# Altium project CPC-UNIFEI.PrjPcb (part 2 of 4)

## Sheet USB.SchDoc
size A4; SheetNumber: 5; SheetTotal: 14
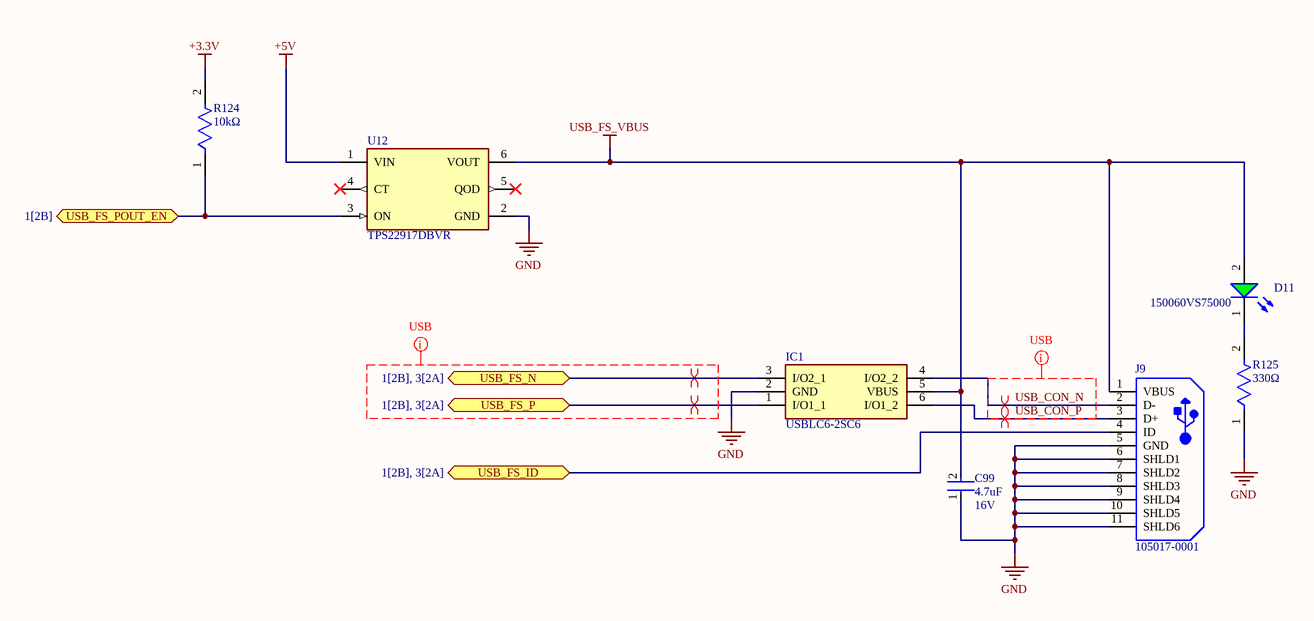
[diagram p2: USB.SchDoc]

### Parts
C99  Voltage: 16V  Capacitance: 4.7uF  [FP-C1608-080-0_1-IPC_B]  (hidden comment: C1608X5R1C475K080AC)
D11  150060VS75000  [WL-SMCW_0603_150060xx75000]
IC1  USBLC6-2SC6  [SOT95P280X145-6N]
J9  105017-0001  [USB-MICRO-B_V]
R124  Resistance: 10kΩ  [FP-RC0603-0_55-IPC_B]  (hidden comment: RC0603FR-0710KL)
R125  Resistance: 330Ω  [FP-CRCW0603-e3-MFG]  (hidden comment: CRCW0603330RFKEA)
U12  TPS22917DBVR  [FP-DBV0006A-MFG]

### Ports
USB_FS_ID (bidir, see 1[2B], 3[2A]), USB_FS_N (bidir, see 1[2B], 3[2A]), USB_FS_P (bidir, see 1[2B], 3[2A]), USB_FS_POUT_EN (bidir, see 1[2B])

### Nets
+3.3V: R124.2
+5V: U12.1(VIN)
GND: C99.1 IC1.2(GND) J9.5(GND) J9.6(SHLD1) J9.7(SHLD2) J9.8(SHLD3) J9.9(SHLD4) J9.10(SHLD5) J9.11(SHLD6) R125.1 U12.2(GND)
USB_FS_VBUS: C99.2 D11.2(A) IC1.5(VBUS) J9.1(VBUS) U12.6(VOUT)
PA10: J9.4(ID) ; port USB_FS_ID
PD10: R124.1 U12.3(ON) ; port USB_FS_POUT_EN
USB_CON_N: IC1.4(I/O2_2) J9.2(D-)
USB_CON_P: IC1.6(I/O1_2) J9.3(D+)
USB_FS_N: IC1.3(I/O2_1) ; port USB_FS_N
USB_FS_P: IC1.1(I/O1_1) ; port USB_FS_P
NetD11_1: D11.1(K) R125.2

Not connected (* = marked no-connect by the designer): U12 4(CT)* 5(QOD)*

### Layout directives
differential pair: USB_CON_N, USB_CON_P, USB_FS_N, USB_FS_P
net class USB; rule Differential Pairs Routing [Pref Gap = 7.874mil    Min Gap  = 7.874mil    Max Gap  = 7.874milPref Width = 5.566mil    Min Width  = 4.547mil    Max Width  = 7mil]: (no net found under the mark), USB_CON_N, USB_CON_P

### Library data of the parts
C99 = CMP-2000-04981-2: Multilayer Ceramic Capacitors 4.7μF ±10% 16V X5R SMD 0603; Tolerance: 10%; Thickness: 0.035inch; Length: 1.6mm; Width: 0.031inch; Height: 0.8mm; Package Quantity: 1; Construction: Flat; Weight: 7.1E-05oz; Depth: 0.8mm; Case Code (Metric): 1608; Series: C; Lead Free: Lead Free; Voltage Rating: 16V; Voltage Rating (DC): 16V; Termination: SMD/SMT; Dielectric: X5R; REACH SVHC: No SVHC; RoHS Compliant: Yes; Case Code (Imperial): 0603; Case/Package: 0603; Mount: Surface Mount; Dielectric Material: Ceramic; Packaging: Tape and Reel; Min Operating Temperature: -55°C; Max Operating Temperature: 85°C
D11 = CMP-1426-00006-6: NexarPartId: 29717778; Reverse Voltage: 5V; Forward Voltage: 2V; Viewing Angle: 140°; Luminous Intensity: 40mcd; Test Current: 20mA; Max Junction Temperature (Tj): 95°C; Wavelength: 570nm; Forward Current: 100mA; Color: Green; Lens Style: Clear, Rectangular; Power Dissipation: 72mW; Peak Wavelength: 572nm; Packaging: Tape and Reel; REACH SVHC: Unknown; Width: 800µm; Max Operating Temperature: 85°C; Number of Pins: 2; RoHS: Compliant; Dominant Wavelength: 570nm; Min Operating Temperature: -40°C; Case Code (Imperial): 0603; Height: 700µm; Length: 1.6mm; Case Code (Metric): 1608; Case/Package: 0603; Max Reverse Voltage (DC): 5V; Mount: Surface Mount
IC1 = USBLC6-2SC6: Integrated Circuit; Manufacturer_Name: STMicroelectronics; Datasheet Link: http://www.st.com/st-web-ui/static/active/en/resource/technical/document/datasheet/CD00050750.pdf; Height: 1.45mm; Manufacturer_Part_Number: USBLC6-2SC6; Mouser Part Number: 511-USBLC6-2SC6; Mouser Price/Stock: https://www.mouser.co.uk/ProductDetail/STMicroelectronics/USBLC6-2SC6?qs=po45yt2pPpu%2FhNIlwQdTlg%3D%3D; Arrow Part Number: USBLC6-2SC6; Arrow Price/Stock: https://www.arrow.com/en/products/usblc6-2sc6/stmicroelectronics?region=nac
J9 = CMP-2000-05827-1: Micro-USB B Receptacle, Right Angle, Bottom Mount, Surface Mount, with Solder Tabs, -30 to 85 degC, 5-Pin USB, RoHS, Tape and Reel; Manufacturer: Molex; Featured Product: Micro-USBConnectorsUSBConnectors; Other Names: WM1399DKR; Package Version: Rev. F, 12/2012; Number of Contacts: 5; Connector Type: USB-microB; Catalog Drawings: 1050170001; 3D Model: 105017-0001.stp; Mating Products: WM17145-ND-CABLEMICROUSBBTOSTDA1.0MWM17147-ND-CABLEMICROUSBBTOSTDA2.0MWM17146-ND-CABLEMICROUSBBTOSTDA1.5M; PCN Assembly/Origin: ResinSupplier21/Oct/2015; Voltage - Max: 30V; Online Catalog: Molex-MicroUSB; Manufacturer URL: http://www.molex.com/; Package Description: 5-Leads USB, Micro B, Body 7.5 x 5 mm, Pitch 0.65 mm; Datasheet URL: http://www.molex.com/elqNow/elqRedir.htm?ref=http://www.molex.com/webdocs/datasheets/pdf/en-us/1050170001_IO_CONNECTORS.pdf; Ingress Protection: -; Datasheet Version: 03/2016; Mounting Type: BoardCutout,SurfaceMount,RightAngle; Circuits: 5; Standard Package: 1; Package Reference: MICRO-B; Package URL: http://www.molex.com/pdm_docs/sd/1050170001_sd.pdf; Category: Connectors,Interconnects; Series: -; RoHS Information: 1050170001CertofCompliance; Features: Shielded,SolderRetention; Family: USB,DVI,HDMIConnectors; Specifications: -; Gender: Receptacle; Packaging: Digi-Reel®; Mounting Technology: SurfaceMount
R124 = CMP-2100-03664-2: RES 10K OHM 1% 1/10W 0603; Voltage Rating: 75V; Voltage Rating (DC): 50V; Power Rating: 100mW; Temperature Coefficient: 100ppm/°C; Depth: 0.8mm; Termination: SMD/SMT; Resistor Type: Thick Film; Series: RC; Construction: Rectangular; Features: Moisture Resistant; Packaging: Tape and Reel; Min Operating Temperature: -55°C; Number of Terminations: 2; Lead Pitch: 0.3mm; RoHS Compliant: Yes; Case/Package: 0603; Resistance Tolerance: 1%; Military Standard: Not; Weight: 7.1E-05oz; Number of Pins: 2; Tolerance: 1%; Length: 1.6mm; Case Code (Imperial): 0603; Lead Free: Lead Free; Width: 0.8mm; Max Power Dissipation: 100mW; Height: 0.45mm; Max Operating Temperature: 155°C; Case Code (Metric): 1608; Size Code: 0603
R125 = CMP-1012-00454-3: RES Thick Film, 330Ω, 1%, 0.1W, 100ppm/°C, 0603; Voltage Rating: 75V; Max Power Dissipation: 100mW; Depth: 0.85mm; Contact Plating: Tin; Package Quantity: 10; Termination: SMD/SMT; Tolerance: 1%; Height: 0.45mm; Number of Terminations: 2; Radiation Hardening: No; Features: Automotive AEC-Q200; Case/Package: 0603; Mount: Surface Mount; Case Code (Metric): 1608; Lead Free: Lead Free; Temperature Coefficient: 100ppm/°C; Weight: 7.1E-05oz; Military Standard: Not; Packaging: Tape and Reel; Max Operating Temperature: 155°C; Voltage Rating (DC): 75V; Length: 1.55mm; Min Operating Temperature: -55°C; Composition: Thick Film; Case Code (Imperial): 0603; Width: 0.033inch; Power Rating: 100mW
U12 = CMP-04912-000029-1: IC PWR SWITCH P-CHAN 1:1 SOT23-6; Number of Outputs: 1; Output Configuration: High Side; Fault Protection: Reverse Current; Interface: On/Off; Max Output Current: 2A; Max Operating Temperature: 125°C; Case/Package: SOT-23-6; Packaging: Tape and Reel; Number of Channels: 1; Min Operating Temperature: -40°C

## Sheet STM32_IO.SchDoc
size A3; SheetNumber: 3; SheetTotal: 14
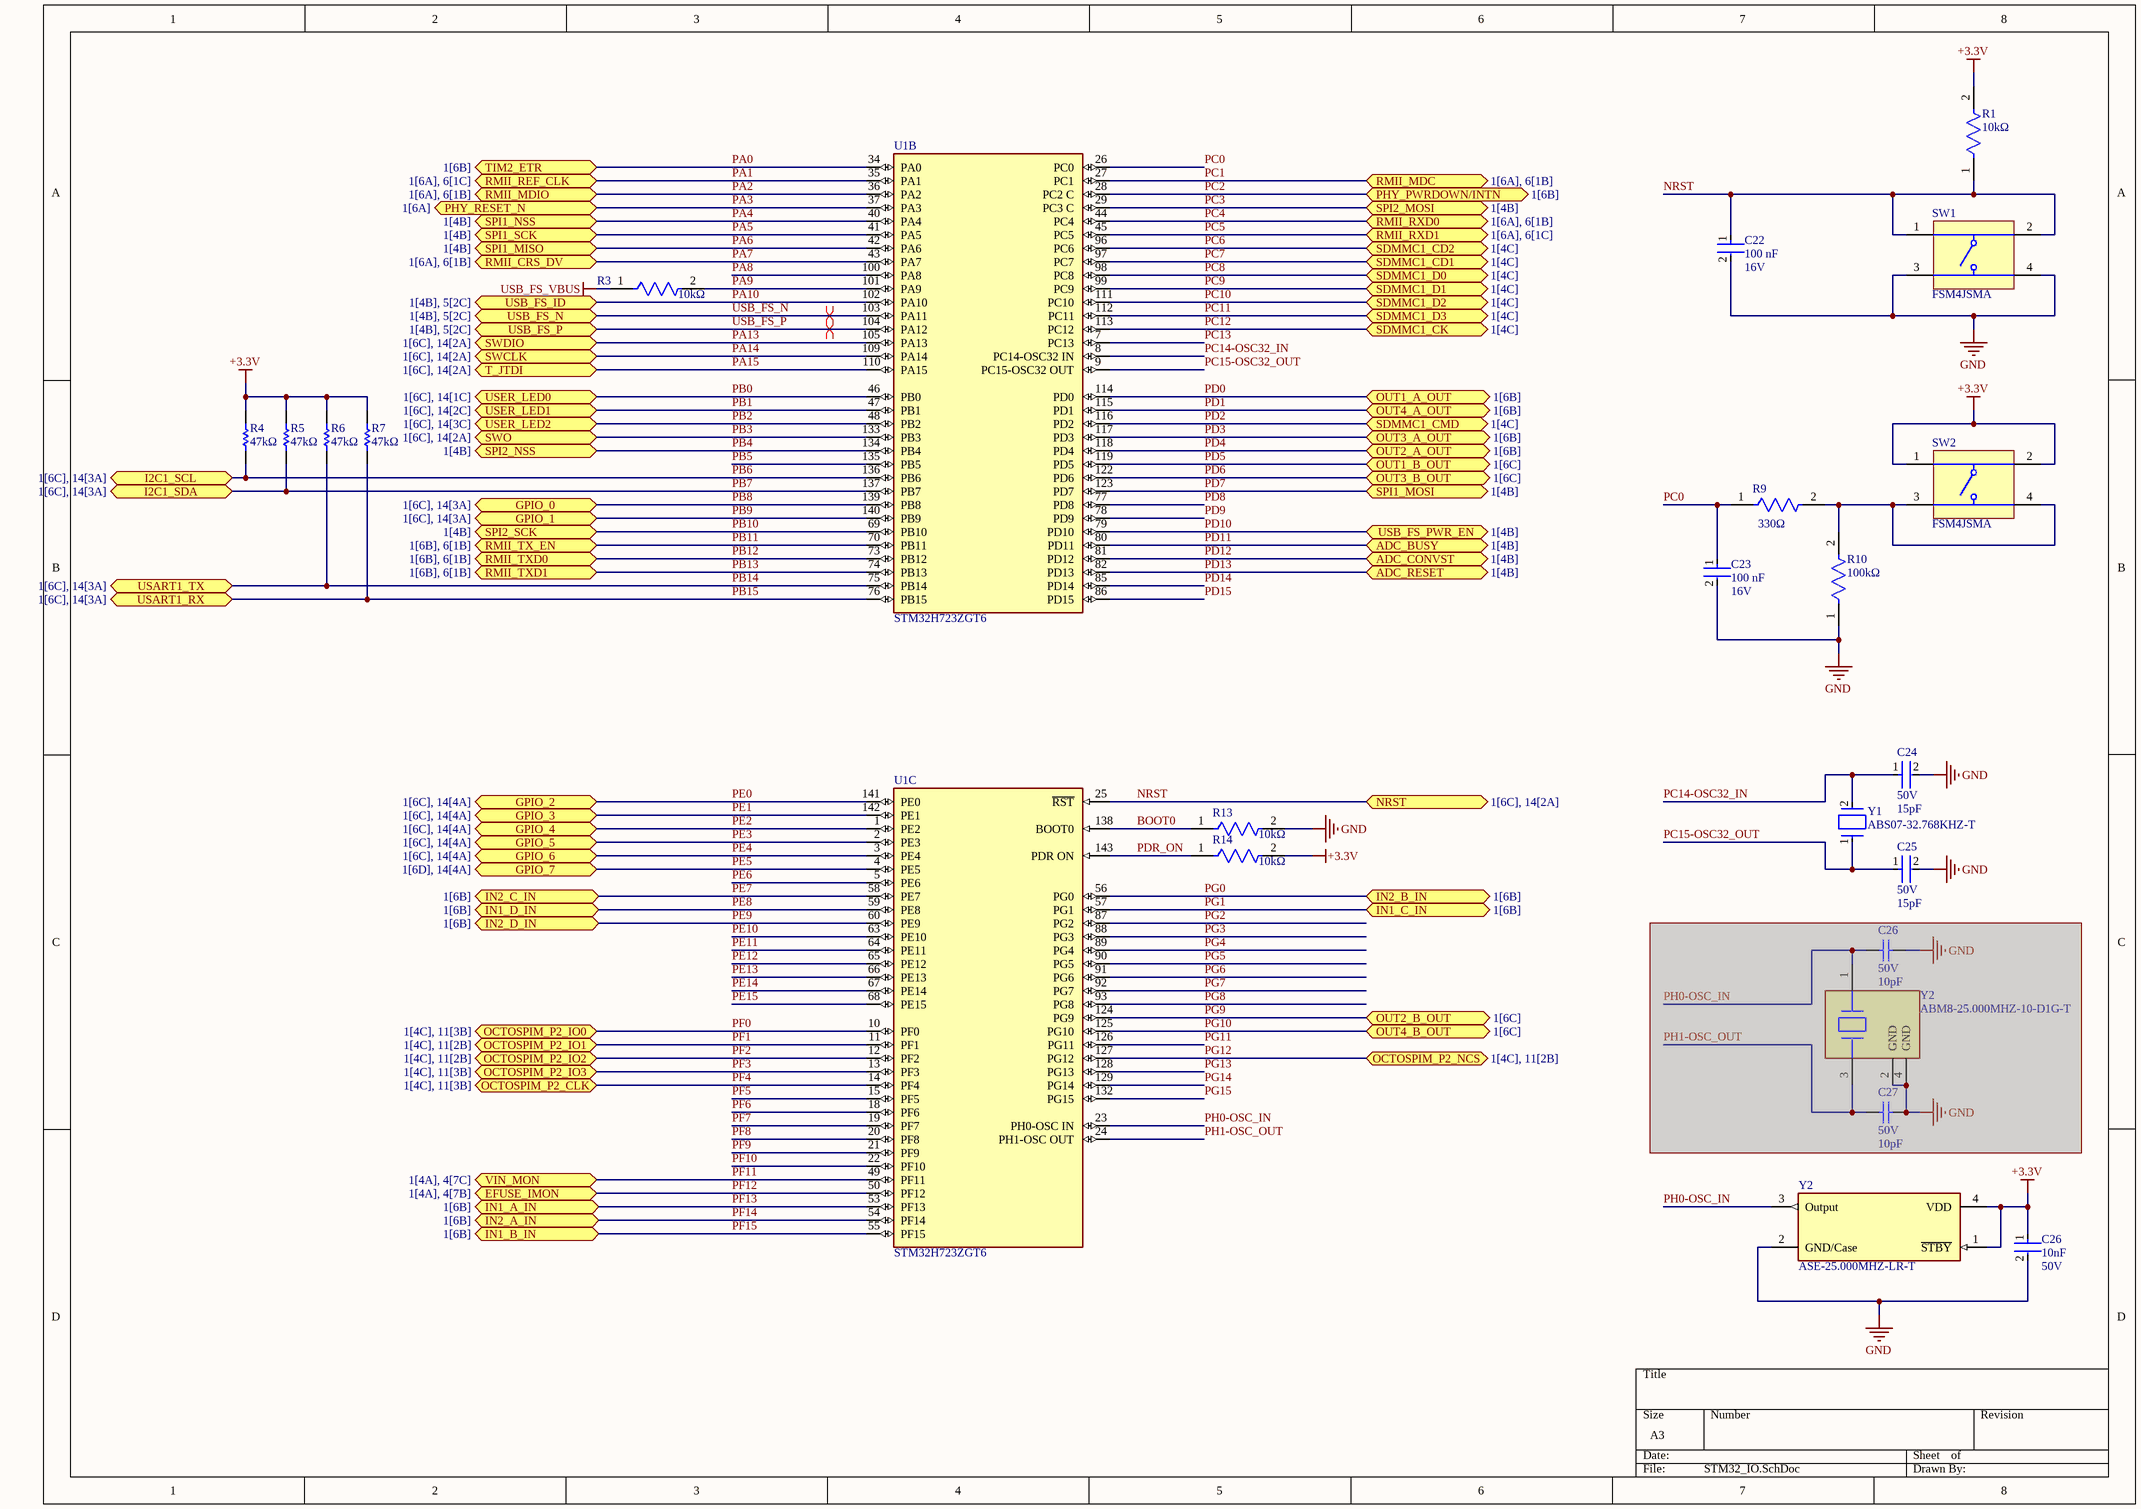
[diagram p3: STM32_IO.SchDoc]

### Parts
(Parts that share a designator on the sheet are numbered #1, #2 ... from top to bottom, then left to right.)
C22  Capacitance: 100 nF  Voltage Rating: 16V  [FP-CL752-IPC_B]  (hidden comment: CL05B104KO5VPNC)
C23  Capacitance: 100 nF  Voltage Rating: 16V  [FP-CL752-IPC_B]  (hidden comment: CL05B104KO5VPNC)
C24  Voltage: 50V  Capacitance: 15pF  [FP-0402-L_1_0_1-W_0_5_0_1-IPC_B]  (hidden comment: 04025A150JAT2A)
C25  Voltage: 50V  Capacitance: 15pF  [FP-0402-L_1_0_1-W_0_5_0_1-IPC_B]  (hidden comment: 04025A150JAT2A)
C26#1  Voltage Rating: 50V  Capacitance: 10pF  [CAPC1005X55X25NL05T05]  (hidden comment: CC0402JRNPO9BN100)  (masked out: inside a compile mask, not in the netlist)
C26#2  Voltage: 50V  Capacitance: 10nF  [FP-CL165-IPC_B]  (hidden comment: CL05B103KB5NNNC)
C27#1  Voltage Rating: 50V  Capacitance: 10pF  [CAPC1005X55X25NL05T05]  (hidden comment: CC0402JRNPO9BN100)  (masked out: inside a compile mask, not in the netlist)
R1  Resistance: 10kΩ  [FP-RC0603-0_55-IPC_B]  (hidden comment: RC0603FR-0710KL)
R3  Resistance: 10kΩ  [FP-RC0603-0_55-IPC_B]  (hidden comment: RC0603FR-0710KL)
R4  Resistance: 47kΩ  [RESC1608X55X25ML10T15]  (hidden comment: RC0603FR-1347KL)
R5  Resistance: 47kΩ  [RESC1608X55X25ML10T15]  (hidden comment: RC0603FR-1347KL)
R6  Resistance: 47kΩ  [RESC1608X55X25ML10T15]  (hidden comment: RC0603FR-1347KL)
R7  Resistance: 47kΩ  [RESC1608X55X25ML10T15]  (hidden comment: RC0603FR-1347KL)
R9  Resistance: 330Ω  [FP-CRCW0603-e3-MFG]  (hidden comment: CRCW0603330RFKEA)
R10  Resistance: 100kΩ  [FP-CRCW0603-e3-IPC_B]  (hidden comment: CRCW0603100KFKEC)
R13  Resistance: 10kΩ  [FP-RC0603-0_55-IPC_B]  (hidden comment: RC0603FR-0710KL)
R14  Resistance: 10kΩ  [FP-RC0603-0_55-IPC_B]  (hidden comment: RC0603FR-0710KL)
SW1  FSM4JSMA  [TECO-FSM4JSMA_V]
SW2  FSM4JSMA  [TECO-FSM4JSMA_V]
U1  STM32H723ZGT6  [CQFP50P2200X2200X160-144M]  (parts B,C of 3)
Y1  ABS07-32.768KHZ-T  [FP-ABS07-MFG]
Y2#1  ABM8-25.000MHZ-10-D1G-T  [FP-ABM8-MFG]  (masked out: inside a compile mask, not in the netlist)
Y2#2  ASE-25.000MHZ-LR-T  [FP-ASE-MFG]

### Ports
ADC_BUSY (bidir, see 1[4B]), ADC_CONVST (bidir, see 1[4B]), ADC_RESET (bidir, see 1[4B]), EFUSE_IMON (bidir, see 1[4A], 4[7B]), GPIO_0 (bidir, see 1[6C], 14[3A]), GPIO_1 (bidir, see 1[6C], 14[3A]), GPIO_2 (bidir, see 1[6C], 14[4A]), GPIO_3 (bidir, see 1[6C], 14[4A]), GPIO_4 (bidir, see 1[6C], 14[4A]), GPIO_5 (bidir, see 1[6C], 14[4A]), GPIO_6 (bidir, see 1[6C], 14[4A]), GPIO_7 (bidir, see 1[6D], 14[4A]), I2C1_SCL (bidir, see 1[6C], 14[3A]), I2C1_SDA (bidir, see 1[6C], 14[3A]), IN1_A_IN (bidir, see 1[6B]), IN1_B_IN (bidir, see 1[6B]), IN1_C_IN (bidir, see 1[6B]), IN1_D_IN (bidir, see 1[6B]), IN2_A_IN (bidir, see 1[6B]), IN2_B_IN (bidir, see 1[6B]), IN2_C_IN (bidir, see 1[6B]), IN2_D_IN (bidir, see 1[6B]), NRST (bidir, see 1[6C], 14[2A]), OCTOSPIM_P2_CLK (bidir, see 1[4C], 11[3B]), OCTOSPIM_P2_IO0 (bidir, see 1[4C], 11[3B]), OCTOSPIM_P2_IO1 (bidir, see 1[4C], 11[2B]), OCTOSPIM_P2_IO2 (bidir, see 1[4C], 11[2B]), OCTOSPIM_P2_IO3 (bidir, see 1[4C], 11[3B]), OCTOSPIM_P2_NCS (bidir, see 1[4C], 11[2B]), OUT1_A_OUT (bidir, see 1[6B]), OUT1_B_OUT (bidir, see 1[6C]), OUT2_A_OUT (bidir, see 1[6B]), OUT2_B_OUT (bidir, see 1[6C]), OUT3_A_OUT (bidir, see 1[6B]), OUT3_B_OUT (bidir, see 1[6C]), OUT4_A_OUT (bidir, see 1[6B]), OUT4_B_OUT (bidir, see 1[6C]), PHY_PWRDOWN/INTN (bidir, see 1[6B]), PHY_RESET_N (bidir, see 1[6A]), RMII_CRS_DV (bidir, see 1[6A], 6[1B]), RMII_MDC (bidir, see 1[6A], 6[1B]), RMII_MDIO (bidir, see 1[6A], 6[1B]), RMII_REF_CLK (bidir, see 1[6A], 6[1C]), RMII_RXD0 (bidir, see 1[6A], 6[1B]), RMII_RXD1 (bidir, see 1[6A], 6[1C]), RMII_TX_EN (bidir, see 1[6B], 6[1B]), RMII_TXD0 (bidir, see 1[6B], 6[1B]), RMII_TXD1 (bidir, see 1[6B], 6[1B]), SDMMC1_CD1 (bidir, see 1[4C]), SDMMC1_CD2 (bidir, see 1[4C]), SDMMC1_CK (bidir, see 1[4C]), SDMMC1_CMD (bidir, see 1[4C]), SDMMC1_D0 (bidir, see 1[4C]), SDMMC1_D1 (bidir, see 1[4C]), SDMMC1_D2 (bidir, see 1[4C]), SDMMC1_D3 (bidir, see 1[4C]), SPI1_MISO (bidir, see 1[4B]), SPI1_MOSI (bidir, see 1[4B]), SPI1_NSS (bidir, see 1[4B]), SPI1_SCK (bidir, see 1[4B]), SPI2_MOSI (bidir, see 1[4B]), SPI2_NSS (bidir, see 1[4B]), SPI2_SCK (bidir, see 1[4B]), SWCLK (bidir, see 1[6C], 14[2A]), SWDIO (bidir, see 1[6C], 14[2A]), SWO (bidir, see 1[6C], 14[2A]), T_JTDI (bidir, see 1[6C], 14[2A]), TIM2_ETR (bidir, see 1[6B]), USART1_RX (bidir, see 1[6C], 14[3A]), USART1_TX (bidir, see 1[6C], 14[3A]), USB_FS_ID (bidir, see 1[4B], 5[2C]), USB_FS_N (bidir, see 1[4B], 5[2C]), USB_FS_P (bidir, see 1[4B], 5[2C]), USB_FS_PWR_EN (bidir, see 1[4B]), USER_LED0 (bidir, see 1[6C], 14[1C]), USER_LED1 (bidir, see 1[6C], 14[2C]), USER_LED2 (bidir, see 1[6C], 14[3C]), VIN_MON (bidir, see 1[4A], 4[7C])

### Nets
+3.3V: C26#2.1 R1.2 R4.2 R5.2 R6.2 R7.2 R14.2 SW2.1 SW2.2 Y2#2.1(~{STBY}) Y2#2.4(VDD)
GND: C22.2 C23.2 C24.2 C25.2 C26#2.2 R10.1 R13.2 SW1.3 SW1.4 Y2#2.2(GND/Case)
USB_FS_VBUS: R3.1
BOOT0: R13.1 U1.138(BOOT0)
NRST: C22.1 R1.1 SW1.1 SW1.2 U1.25(~{RST}) ; port NRST
PA0: U1.34(PA0) ; port TIM2_ETR
PA1: U1.35(PA1) ; port RMII_REF_CLK
PA2: U1.36(PA2) ; port RMII_MDIO
PA3: U1.37(PA3) ; port PHY_RESET_N
PA4: U1.40(PA4) ; port SPI1_NSS
PA5: U1.41(PA5) ; port SPI1_SCK
PA6: U1.42(PA6) ; port SPI1_MISO
PA7: U1.43(PA7) ; port RMII_CRS_DV
PA8: U1.100(PA8)
PA9: R3.2 U1.101(PA9)
PA10: U1.102(PA10) ; port USB_FS_ID
PA13: U1.105(PA13) ; port SWDIO
PA14: U1.109(PA14) ; port SWCLK
PA15: U1.110(PA15) ; port T_JTDI
PB0: U1.46(PB0) ; port USER_LED0
PB1: U1.47(PB1) ; port USER_LED1
PB2: U1.48(PB2) ; port USER_LED2
PB3: U1.133(PB3) ; port SWO
PB4: U1.134(PB4) ; port SPI2_NSS
PB5: U1.135(PB5)
PB6: R4.1 U1.136(PB6) ; port I2C1_SCL
PB7: R5.1 U1.137(PB7) ; port I2C1_SDA
PB8: U1.139(PB8) ; port GPIO_0
PB9: U1.140(PB9) ; port GPIO_1
PB10: U1.69(PB10) ; port SPI2_SCK
PB11: U1.70(PB11) ; port RMII_TX_EN
PB12: U1.73(PB12) ; port RMII_TXD0
PB13: U1.74(PB13) ; port RMII_TXD1
PB14: R6.1 U1.75(PB14) ; port USART1_TX
PB15: R7.1 U1.76(PB15) ; port USART1_RX
PC0: C23.1 R9.1 U1.26(PC0)
PC1: U1.27(PC1) ; port RMII_MDC
PC2: U1.28(PC2_C) ; port PHY_PWRDOWN/INTN
PC3: U1.29(PC3_C) ; port SPI2_MOSI
PC4: U1.44(PC4) ; port RMII_RXD0
PC5: U1.45(PC5) ; port RMII_RXD1
PC6: U1.96(PC6) ; port SDMMC1_CD2
PC7: U1.97(PC7) ; port SDMMC1_CD1
PC8: U1.98(PC8) ; port SDMMC1_D0
PC9: U1.99(PC9) ; port SDMMC1_D1
PC10: U1.111(PC10) ; port SDMMC1_D2
PC11: U1.112(PC11) ; port SDMMC1_D3
PC12: U1.113(PC12) ; port SDMMC1_CK
PC13: U1.7(PC13)
PC14-OSC32_IN: C24.1 U1.8(PC14-OSC32_IN) Y1.2
PC15-OSC32_OUT: C25.1 U1.9(PC15-OSC32_OUT) Y1.1
PD0: U1.114(PD0) ; port OUT1_A_OUT
PD1: U1.115(PD1) ; port OUT4_A_OUT
PD2: U1.116(PD2) ; port SDMMC1_CMD
PD3: U1.117(PD3) ; port OUT3_A_OUT
PD4: U1.118(PD4) ; port OUT2_A_OUT
PD5: U1.119(PD5) ; port OUT1_B_OUT
PD6: U1.122(PD6) ; port OUT3_B_OUT
PD7: U1.123(PD7) ; port SPI1_MOSI
PD8: U1.77(PD8)
PD9: U1.78(PD9)
PD10: U1.79(PD10) ; port USB_FS_PWR_EN
PD11: U1.80(PD11) ; port ADC_BUSY  [project net ADC_BUSY]
PD12: U1.81(PD12) ; port ADC_CONVST  [project net ADC_CONVST]
PD13: U1.82(PD13) ; port ADC_RESET  [project net ADC_RESET]
PD14: U1.85(PD14)
PD15: U1.86(PD15)
PDR_ON: R14.1 U1.143(PDR_ON)
PE0: U1.141(PE0) ; port GPIO_2
PE1: U1.142(PE1) ; port GPIO_3
PE2: U1.1(PE2) ; port GPIO_4
PE3: U1.2(PE3) ; port GPIO_5
PE4: U1.3(PE4) ; port GPIO_6
PE5: U1.4(PE5) ; port GPIO_7
PE6: U1.5(PE6)
PE7: U1.58(PE7) ; port IN2_C_IN
PE8: U1.59(PE8) ; port IN1_D_IN
PE9: U1.60(PE9) ; port IN2_D_IN
PE10: U1.63(PE10)
PE11: U1.64(PE11)
PE12: U1.65(PE12)
PE13: U1.66(PE13)
PE14: U1.67(PE14)
PE15: U1.68(PE15)
PF0: U1.10(PF0) ; port OCTOSPIM_P2_IO0
PF1: U1.11(PF1) ; port OCTOSPIM_P2_IO1
PF2: U1.12(PF2) ; port OCTOSPIM_P2_IO2
PF3: U1.13(PF3) ; port OCTOSPIM_P2_IO3
PF4: U1.14(PF4) ; port OCTOSPIM_P2_CLK
PF5: U1.15(PF5)
PF6: U1.18(PF6)
PF7: U1.19(PF7)
PF8: U1.20(PF8)
PF9: U1.21(PF9)
PF10: U1.22(PF10)
PF11: U1.49(PF11) ; port VIN_MON
PF12: U1.50(PF12) ; port EFUSE_IMON
PF13: U1.53(PF13) ; port IN1_A_IN
PF14: U1.54(PF14) ; port IN2_A_IN
PF15: U1.55(PF15) ; port IN1_B_IN
PG0: U1.56(PG0) ; port IN2_B_IN
PG1: U1.57(PG1) ; port IN1_C_IN
PG2: U1.87(PG2)
PG3: U1.88(PG3)
PG4: U1.89(PG4)
PG5: U1.90(PG5)
PG6: U1.91(PG6)
PG7: U1.92(PG7)
PG8: U1.93(PG8)
PG9: U1.124(PG9) ; port OUT2_B_OUT
PG10: U1.125(PG10) ; port OUT4_B_OUT
PG11: U1.126(PG11)
PG12: U1.127(PG12) ; port OCTOSPIM_P2_NCS
PG13: U1.128(PG13)
PG14: U1.129(PG14)
PG15: U1.132(PG15)
PH0-OSC_IN: U1.23(PH0-OSC_IN) Y2#2.3(Output)
PH1-OSC_OUT: U1.24(PH1-OSC_OUT)
USB_FS_N: U1.103(PA11) ; port USB_FS_N
USB_FS_P: U1.104(PA12) ; port USB_FS_P
NetR9_2: R9.2 R10.2 SW2.3 SW2.4

### Layout directives
differential pair: USB_FS_N, USB_FS_P

### Library data of the parts
C22 C23 = CMP-13271-002128-1: Cap Ceramic 100nF 16V X7R ±10% SMD 0402 +125°C Paper T/R; Length: 0.039inch; Case Code (Metric): 1005; Thickness: 0.022inch; Max Operating Temperature: 125°C; Mount: Surface Mount; Features: Soft Termination; Width: 0.02inch; Min Operating Temperature: -55°C; Tolerance: 10%; Case/Package: 0402; Packaging: Cut Tape; Ratings: AEC-Q200; Case Code (Imperial): 0402; Lead Free: Lead Free
C24 C25 = CMP-2008-02583-2: General Purpose Ceramic Capacitor, 0402, 15pF, 5%, C0G, 30ppm/°C, 50V; Lead Free: Lead Free; Max Operating Temperature: 125°C; Contact Plating: Tin; Temperature Coefficient: 30ppm/°C; Number of Pins: 2; Width: 0.5mm; Voltage Rating (DC): 50V; Mount: Surface Mount; Min Operating Temperature: -55°C; Termination: SMD/SMT; RoHS Compliant: Yes; Construction: Flat; Tolerance: 5%; Case Code (Imperial): 0402; Case/Package: 0402; Dielectric: C0G; Case Code (Metric): 1005; Series: -; Length: 1mm; Height: 0.5mm; REACH SVHC: No SVHC; Package Quantity: 1; Voltage Rating: 50V; Depth: 0.5mm; Radiation Hardening: No; Thickness: 0.022inch; Packaging: Tape and Reel
C26#1 C27#1 = CMP-2100-03589-1: Chip Capacitor, 10 pF, +/- 5%, 50 V, -55 to 125 degC, 0402 (1005 Metric), RoHS, Tape and Reel; Manufacturer: Yageo; Insulation Resistance: 100GR; Dielectric Material: Ceramic; Temperature Coefficient: 30ppm/degC; Dielectric: C0G; Termination: SMD/SMT; Package Reference: 0402; Voltage Rating (DC): 50V; Lead Free: LeadFree; Composition: Ceramic; Tolerance: 5%; Case Code (Metric): 1005; Packaging: TapeandReel; Manufacturer URL: http://www.yageo.com/; REACH SVHC: NoSVHC; Max Operating Temperature: 125degC; Length: 1mm; Mount: SurfaceMount; Depth: 0.5mm; Min Operating Temperature: -55degC; Number of Pins: 2; Width: 0.02inch; Datasheet Version: Rev. 14, 07/2016; Package Quantity: 1; Datasheet URL: http://www.yageo.com/documents/recent/UPY-GP_NP0_16V-to-50V_14.pdf; Case Code (Imperial): 0402; RoHSCompliant: True; Radiation Hardening: No; Height: 0.5mm; Case/Package: 0402; Thickness: 0.022inch; Package Description: 2-Pin Surface Mount Device, Body 1 x 0.5 mm; Voltage: 50V
C26#2 = CMP-13271-000387-1: Cap Ceramic 10nF 50V X7R ±10% SMD 0402 +125°C Paper T/R; Depth: 0.5mm; Length: 1mm; Lead Free: Lead Free; Case Code (Metric): 1005; Width: 0.02inch; Min Operating Temperature: -55°C; Thickness: 0.022inch; Package Quantity: 1; Mount: Surface Mount; Height: 0.5mm; Material: Ceramic; Tolerance: 10%; Case Code (Imperial): 0402; Radiation Hardening: No; Case/Package: 0402; Max Operating Temperature: 125°C; Voltage Rating (DC): 50V; Contact Plating: Tin; Packaging: Tape and Reel; Voltage Rating: 50V; Dielectric: X7R
R1 R3 R13 R14 = CMP-2100-03664-2: as R124 on sheet USB; Depth: 0.8mm; Termination: SMD/SMT; Resistor Type: Thick Film; Series: RC; Construction: Rectangular; Features: Moisture Resistant; Packaging: Tape and Reel; Min Operating Temperature: -55°C; Number of Terminations: 2; Lead Pitch: 0.3mm; RoHS Compliant: Yes; Case/Package: 0603; Resistance Tolerance: 1%; Military Standard: Not; Weight: 7.1E-05oz; Number of Pins: 2; Tolerance: 1%; Length: 1.6mm; Case Code (Imperial): 0603; Lead Free: Lead Free; Width: 0.8mm; Max Power Dissipation: 100mW; Height: 0.45mm; Max Operating Temperature: 155°C; Case Code (Metric): 1608; Size Code: 0603
R4-R7 = CMP-2000-04221-1: Manufacturer: Yageo; Part Number: RC0603FR-1347KL
R9 = CMP-1012-00454-3: as R125 on sheet USB; Depth: 0.85mm; Contact Plating: Tin; Package Quantity: 10; Termination: SMD/SMT; Tolerance: 1%; Height: 0.45mm; Number of Terminations: 2; Radiation Hardening: No; Features: Automotive AEC-Q200; Case/Package: 0603; Mount: Surface Mount; Case Code (Metric): 1608; Lead Free: Lead Free; Temperature Coefficient: 100ppm/°C; Weight: 7.1E-05oz; Military Standard: Not; Packaging: Tape and Reel; Max Operating Temperature: 155°C; Voltage Rating (DC): 75V; Length: 1.55mm; Min Operating Temperature: -55°C; Composition: Thick Film; Case Code (Imperial): 0603; Width: 0.033inch; Power Rating: 100mW
R10 = CMP-2000-03822-2: RES Thick Film, 100kΩ, 1%, 0.1W, 100ppm/°C, 0603; Power Rating: 100mW; Height: 0.02inch; Min Operating Temperature: -55°C; Length: 0.061inch; Temperature Coefficient: 100ppm/°C; Number of Terminations: 2; Packaging: Tape and Reel; Case Code (Imperial): 0603; Case/Package: 0603; Contact Plating: Tin; Radiation Hardening: No; Lead Free: Lead Free; Depth: 0.85mm; Case Code (Metric): 1608; Max Power Dissipation: 100mW; Features: Automotive AEC-Q200; Tolerance: 1%; Max Operating Temperature: 155°C; Composition: Thick Film; Military Standard: Not; Width: 0.033inch
SW1 SW2 = CMP-2000-05602-2: Swicth, SPST, 24 V, -35 to 85 degC, 4-Pin SMD, RoHS, Tape and Reel; Manufacturer: TE Connectivity; Switch Travel: 0.25mm; Mechanical Life: 100000Cycles; Contact Current Rating: 50mA; Operating Force: 1.57N; Actuator Material: Polyamide; Contact Resistance: 100mOhm; Voltage Rating: 24V; Illumination Type: Illuminated; Actuator Length: 0.055inch; Max Voltage Rating (DC): 12V; Case\/Package: SMD/SMT; Orientation: Straight; Datasheet URL: http://www.te.com/commerce/DocumentDelivery/DDEController?Action=showdoc&DocId=Customer+Drawing%7F2-1437565-7%7FV%7Fpdf%7FEnglish%7FENG_CD_2-1437565-7_V.pdf%7F4-1437565-2; Min Operating Temperature: -35degC; Packaging: LoosePiece; Termination: GullWing; Throw Configuration: SPST; Package Description: 4-Pin Surface Mount Device, Body 6 x 6 mm, Pitch 4.5 mm; Mounting Technology: SurfaceMount; Contact Plating: Silver; Datasheet Version: Rev. V, 02/2015; RoHSCompliant: true; Max Operating Temperature: 85degC; Length: 6mm; Voltage Rating (DC): 24V; Electrical Life: 100000Cycles; Current Rating: 50mA; Package Quantity: 750; Mount: SurfaceMount; Package Reference: FSM4JSMA; Manufacturer URL: http://www.te.com/; Width: 6mm; REACH SVHC: Unknown; Contact Material: CopperAlloy
U1 = STM32H723ZGT6: RISC Microcontroller, 32-Bit, FLASH, CORTEX-M7 CPU, 550MHz, CMOS, PQFP144; Manufacturer: STMicroelectronics; Interface: 39,40,224,1514,1515,1518,1532,1533Interface; Memory Format: 4498,11064MemoryType; Data Bus Width: 32b; Density: 1MB; Max Supply Voltage: 3.6V; Min Supply Voltage: 1.62V; Nominal Supply Current: 4uA; Number of A/D Converters: 1NUMBER; Number of ADC Channels: 16NUMBER; Number of I2C Channels: 5NUMBER; Number of I/Os: 112NUMBER; Number of SPI Channels: 6NUMBER; Number of Timers/Counters: 4NUMBER; RAM Size: 564KB; Supplier: Arrow Electronics; Supplier Part Number: STM32H723ZGT6; Manufacturer Part Number: STM32H723ZGT6; RoHS: No; Category: Microcontrollers; Stock: 2596; Pricing: 1=9.275, 10=9.182, 25=9.09, 50=8.999, 120=8.909, 300=8.175, 540=8.094 (USD); Min Operating Temperature: -40°C; Max Operating Temperature: 85°C; Frequency: 550MHz; Memory Size: 1MB; Number of Ethernet Channels: 1NUMBER; Number of UART Channels: 6NUMBER; Number of USB Channels: 1NUMBER; Height: 1.6mm
Y1 = CMP-0447-00001-4: Crystal 32.768kHz ±20ppm (Tol) 12.5pF FUND 70kΩ 2-Pin CSMD T/R; ESR (Equivalent Series Resistance): 70kR; Radiation Hardening: No; Frequency: 32.768kHz; Length: 3.2mm; Max Operating Temperature: 85°C; Number of Pins: 2; Series: ABS07; Min Operating Temperature: -40°C; Frequency Tolerance: 20ppm; Packaging: Tape and Reel; Height: 0.9mm; Width: 1.5mm; Depth: 1.5mm; Load Capacitance: 12.5pF; RoHS Compliant: Yes; Tolerance: 20ppm; Termination: SMD/SMT; Lead Free: Lead Free; Series Resistance: 70kR; REACH SVHC: No SVHC; Case/Package: CSMD; Operating Frequency: 32.768 kHz; Package Quantity: 3000
Y2#1 = CMP-27762-010178-1: Crystal 25MHz ±10ppm 10pF SMD-4 3.2mm x 2.5mm; Frequency Stability: 15ppm; ESR (Equivalent Series Resistance): 50R; Mount: Surface Mount; Load Capacitance: 10pF; Frequency Tolerance: 10ppm; Max Operating Temperature: 85°C; Frequency: 25MHz; Case/Package: SMD/SMT; Length: 0.126inch; RoHS Compliant: Yes; Min Operating Temperature: -40°C; Width: 0.098inch; Height: 0.031inch; Packaging: Tape and Reel
Y2#2 = CMP-27762-000357-1: XTAL Oscillator 25MHz ±25ppm CMOS 3.3V 4-SMD 3.2mm x 2.5mm; Min Supply Voltage: 3.135V; Max Supply Current: 13mA; Max Supply Voltage: 3.465V; Load Capacitance: 15pF; Height: 0.047inch; Series: ASE; Frequency Stability: 25ppm; Mount: Surface Mount; Case/Package: SMD/SMT; Width: 0.098inch; Operating Frequency: 25 MHz; REACH SVHC: No SVHC; Package Quantity: 1000; Number of Pins: 4; Termination: SMD/SMT; Frequency: 25MHz; Max Operating Temperature: 85°C; Packaging: Tape and Reel; Min Operating Temperature: -40°C; Lead Free: Lead Free; Length: 0.126inch; Operating Supply Voltage: 3.3V

## Sheet DP83640.SchDoc
size A3; SheetNumber: 6; SheetTotal: 14
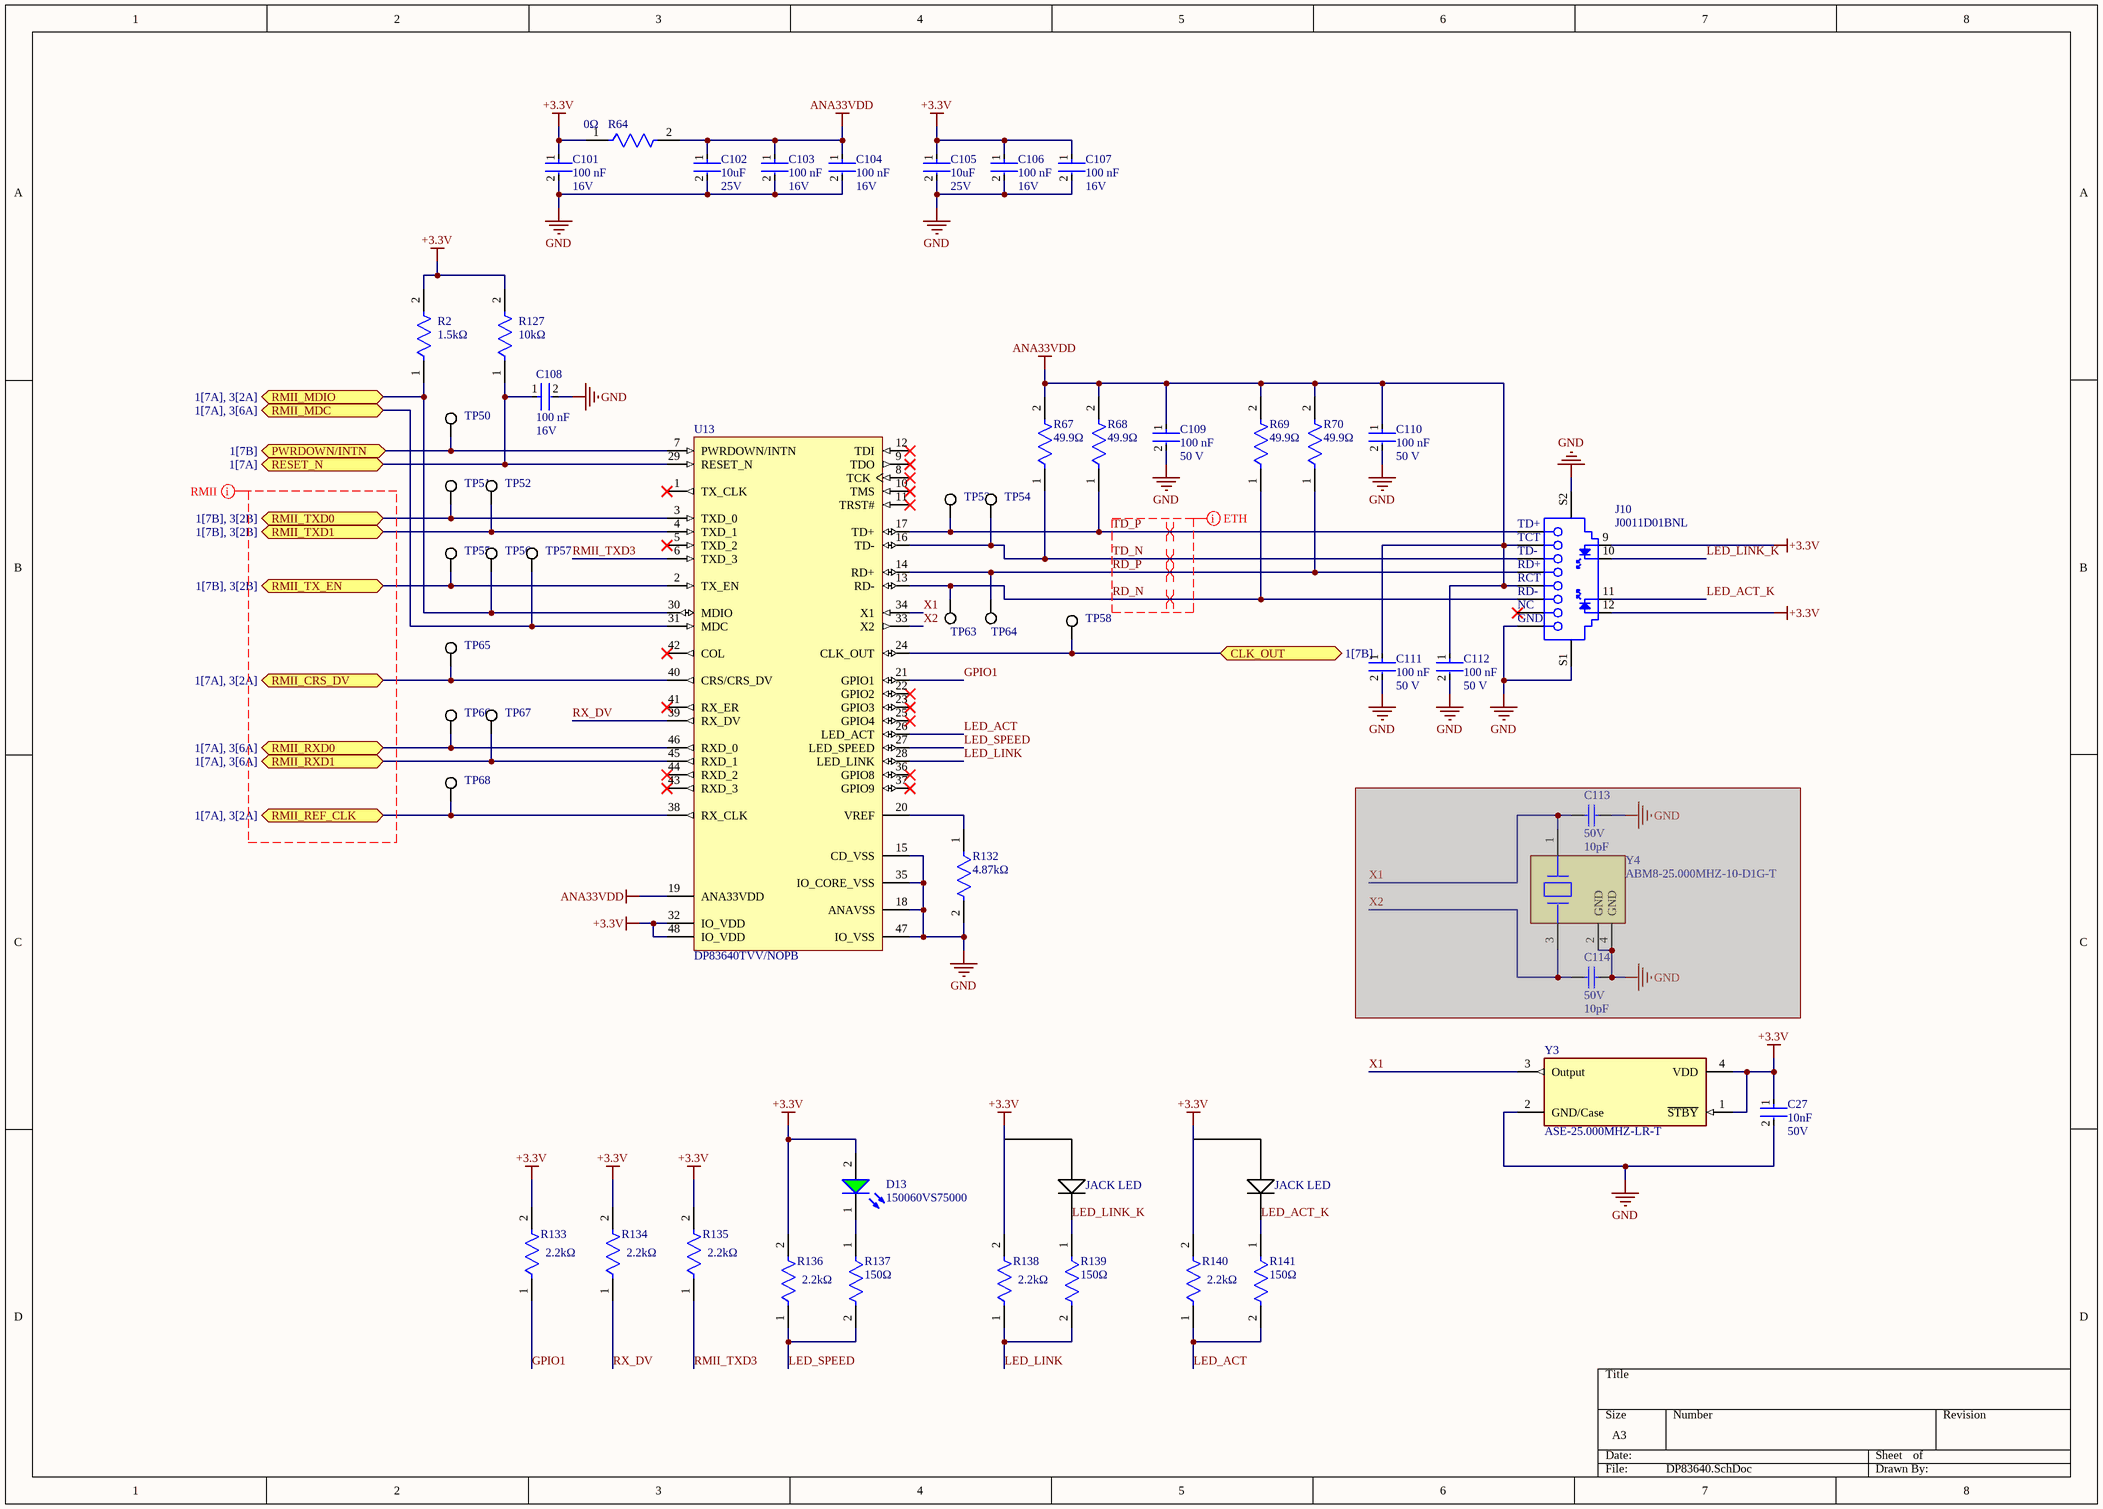
[diagram p4: DP83640.SchDoc]

### Parts
(Parts that share a designator on the sheet are numbered #1, #2 ... from top to bottom, then left to right.)
C27#2  Voltage: 50V  Capacitance: 10nF  [FP-CL165-IPC_B]  (hidden comment: CL05B103KB5NNNC)
C101  Capacitance: 100 nF  Voltage Rating: 16V  [FP-CL752-IPC_B]  (hidden comment: CL05B104KO5VPNC)
C102  Voltage Rating: 25V  Capacitance: 10uF  [FP-C1608-080-IPC_B]  (hidden comment: C1608X5R1E106M080AC)
C103  Capacitance: 100 nF  Voltage Rating: 16V  [FP-CL752-IPC_B]  (hidden comment: CL05B104KO5VPNC)
C104  Capacitance: 100 nF  Voltage Rating: 16V  [FP-CL752-IPC_B]  (hidden comment: CL05B104KO5VPNC)
C105  Voltage Rating: 25V  Capacitance: 10uF  [FP-C1608-080-IPC_B]  (hidden comment: C1608X5R1E106M080AC)
C106  Capacitance: 100 nF  Voltage Rating: 16V  [FP-CL752-IPC_B]  (hidden comment: CL05B104KO5VPNC)
C107  Capacitance: 100 nF  Voltage Rating: 16V  [FP-CL752-IPC_B]  (hidden comment: CL05B104KO5VPNC)
C108  Capacitance: 100 nF  Voltage Rating: 16V  [FP-CL752-IPC_B]  (hidden comment: CL05B104KO5VPNC)
C109  value 100 nF  Voltage Rating: 50 V  [FP-C0603C-CF-IPC_B]  (hidden comment: C0603C104M5RACTU)
C110  value 100 nF  Voltage Rating: 50 V  [FP-C0603C-CF-IPC_B]  (hidden comment: C0603C104M5RACTU)
C111  value 100 nF  Voltage Rating: 50 V  [FP-C0603C-CF-IPC_B]  (hidden comment: C0603C104M5RACTU)
C112  value 100 nF  Voltage Rating: 50 V  [FP-C0603C-CF-IPC_B]  (hidden comment: C0603C104M5RACTU)
C113  Voltage Rating: 50V  Capacitance: 10pF  [CAPC1005X55X25NL05T05]  (hidden comment: CC0402JRNPO9BN100)  (masked out: inside a compile mask, not in the netlist)
C114  Voltage Rating: 50V  Capacitance: 10pF  [CAPC1005X55X25NL05T05]  (hidden comment: CC0402JRNPO9BN100)  (masked out: inside a compile mask, not in the netlist)
D13  150060VS75000  [WL-SMCW_0603_150060xx75000]
J10  J0011D01BNL  [J0011D01BNL]
R2  Resistance: 1.5kΩ  [FP-CRCW0603-e3-IPC_B]  (hidden comment: CRCW06031K50FKEA)
R64  Resistance: 0Ω  [FP-CRCW0603-HPe3-IPC_B]  (hidden comment: CRCW06030000Z0EAHP)
R67  Resistance: 49.9Ω  [FP-AC0603-IPC_B]  (hidden comment: AC0603FR-0749R9L)
R68  Resistance: 49.9Ω  [FP-AC0603-IPC_B]  (hidden comment: AC0603FR-0749R9L)
R69  Resistance: 49.9Ω  [FP-AC0603-IPC_B]  (hidden comment: AC0603FR-0749R9L)
R70  Resistance: 49.9Ω  [FP-AC0603-IPC_B]  (hidden comment: AC0603FR-0749R9L)
R127  Resistance: 10kΩ  [FP-RC0603-0_55-IPC_B]  (hidden comment: RC0603FR-0710KL)
R132  Resistance: 4.87kΩ  [FP-CRCW0603-e3-IPC_B]  (hidden comment: CRCW06034K87FKEA)
R133  Resistance: 2.2kΩ  [FP-AC0603-IPC_B]  (hidden comment: AC0603FR-072K2L)
R134  Resistance: 2.2kΩ  [FP-AC0603-IPC_B]  (hidden comment: AC0603FR-072K2L)
R135  Resistance: 2.2kΩ  [FP-AC0603-IPC_B]  (hidden comment: AC0603FR-072K2L)
R136  Resistance: 2.2kΩ  [FP-AC0603-IPC_B]  (hidden comment: AC0603FR-072K2L)
R137  Resistance: 150Ω  [FP-CRCW0603-e3-IPC_B]  (hidden comment: CRCW0603150RFKEA)
R138  Resistance: 2.2kΩ  [FP-AC0603-IPC_B]  (hidden comment: AC0603FR-072K2L)
R139  Resistance: 150Ω  [FP-CRCW0603-e3-IPC_B]  (hidden comment: CRCW0603150RFKEA)
R140  Resistance: 2.2kΩ  [FP-AC0603-IPC_B]  (hidden comment: AC0603FR-072K2L)
R141  Resistance: 150Ω  [FP-CRCW0603-e3-IPC_B]  (hidden comment: CRCW0603150RFKEA)
TP50  5019  [KSTN-5019_V]  (value not drawn)
TP51  5019  [KSTN-5019_V]  (value not drawn)
TP52  5019  [KSTN-5019_V]  (value not drawn)
TP53  5019  [KSTN-5019_V]  (value not drawn)
TP54  5019  [KSTN-5019_V]  (value not drawn)
TP55  5019  [KSTN-5019_V]  (value not drawn)
TP56  5019  [KSTN-5019_V]  (value not drawn)
TP57  5019  [KSTN-5019_V]  (value not drawn)
TP58  5019  [KSTN-5019_V]  (value not drawn)
TP63  5019  [KSTN-5019_V]  (value not drawn)
TP64  5019  [KSTN-5019_V]  (value not drawn)
TP65  5019  [KSTN-5019_V]  (value not drawn)
TP66  5019  [KSTN-5019_V]  (value not drawn)
TP67  5019  [KSTN-5019_V]  (value not drawn)
TP68  5019  [KSTN-5019_V]  (value not drawn)
U13  DP83640TVV/NOPB  [PT0048A_M]
Y3  ASE-25.000MHZ-LR-T  [FP-ASE-MFG]
Y4  ABM8-25.000MHZ-10-D1G-T  [FP-ABM8-MFG]  (masked out: inside a compile mask, not in the netlist)

### Ports
CLK_OUT (bidir, see 1[7B]), PWRDOWN/INTN (bidir, see 1[7B]), RESET_N (bidir, see 1[7A]), RMII_CRS_DV (bidir, see 1[7A], 3[2A]), RMII_MDC (bidir, see 1[7A], 3[6A]), RMII_MDIO (bidir, see 1[7A], 3[2A]), RMII_REF_CLK (bidir, see 1[7A], 3[2A]), RMII_RXD0 (bidir, see 1[7A], 3[6A]), RMII_RXD1 (bidir, see 1[7A], 3[6A]), RMII_TX_EN (bidir, see 1[7B], 3[2B]), RMII_TXD0 (bidir, see 1[7B], 3[2B]), RMII_TXD1 (bidir, see 1[7B], 3[2B])

### Nets
+3.3V: C27#2.1 C101.1 C105.1 C106.1 C107.1 D13.2(A) J10.9 J10.12 R2.2 R64.1 R127.2 R133.2 R134.2 R135.2 R136.2 R138.2 R140.2 U13.32(IO_VDD) U13.48(IO_VDD) Y3.1(~{STBY}) Y3.4(VDD)
ANA33VDD: C102.1 C103.1 C104.1 C109.1 C110.1 C111.1 C112.1 J10.2(TCT) J10.5(RCT) R64.2 R67.2 R68.2 R69.2 R70.2 U13.19(ANA33VDD)
GND: C27#2.2 C101.2 C102.2 C103.2 C104.2 C105.2 C106.2 C107.2 C108.2 C109.2 C110.2 C111.2 C112.2 J10.8(GND) J10.S1 J10.S2 R132.2 U13.15(CD_VSS) U13.18(ANAVSS) U13.35(IO_CORE_VSS) U13.47(IO_VSS) Y3.2(GND/Case)
GPIO1: R133.1 U13.21(GPIO1)
LED_ACT: R140.1 R141.2 U13.26(LED_ACT)
LED_ACT_K: J10.11 R141.1
LED_LINK: R138.1 R139.2 U13.28(LED_LINK)
LED_LINK_K: J10.10 R139.1
LED_SPEED: R136.1 R137.2 U13.27(LED_SPEED)
PA0: TP58.1 U13.24(CLK_OUT) ; port CLK_OUT
PA1: TP68.1 U13.38(RX_CLK) ; port RMII_REF_CLK
PA2: R2.1 TP56.1 U13.30(MDIO) ; port RMII_MDIO
PA3: C108.1 R127.1 U13.29(RESET_N) ; port RESET_N
PA7: TP65.1 U13.40(CRS/CRS_DV) ; port RMII_CRS_DV
PB11: TP55.1 U13.2(TX_EN) ; port RMII_TX_EN
PB12: TP51.1 U13.3(TXD_0) ; port RMII_TXD0
PB13: TP52.1 U13.4(TXD_1) ; port RMII_TXD1
PC1: TP57.1 U13.31(MDC) ; port RMII_MDC
PC2: TP50.1 U13.7(PWRDOWN/INTN) ; port PWRDOWN/INTN
PC4: TP66.1 U13.46(RXD_0) ; port RMII_RXD0
PC5: TP67.1 U13.45(RXD_1) ; port RMII_RXD1
RD_N: J10.6(RD-) R69.1 TP63.1 U13.13(RD-)
RD_P: J10.4(RD+) R70.1 TP64.1 U13.14(RD+)
RMII_TXD3: R135.1 U13.6(TXD_3)
RX_DV: R134.1 U13.39(RX_DV)
TD_N: J10.3(TD-) R67.1 TP54.1 U13.16(TD-)
TD_P: J10.1(TD+) R68.1 TP53.1 U13.17(TD+)
X1: U13.34(X1) Y3.3(Output)
X2: U13.33(X2)
NetD13_1: D13.1(K) R137.1
NetR132_1: R132.1 U13.20(VREF)

Not connected (* = marked no-connect by the designer): J10 7(NC)*; U13 1(TX_CLK)* 5(TXD_2)* 8(TCK)* 9(TDO)* 10(TMS)* 11(TRST#)* 12(TDI)* 22(GPIO2)* 23(GPIO3)* 25(GPIO4)* 36(GPIO8)* 37(GPIO9)* 41(RX_ER)* 42(COL)* 43(RXD_3)* 44(RXD_2)*

### Layout directives
differential pair: RD_N, RD_P, TD_N, TD_P
rule Matched Net Lengths [Tolerance = 0.5mm]; rule Width Constraint [Pref Impedance = 50.00ohms    Min Impedance = 50.00ohms    Max Impedance = 50.00ohms]; net class RMII: (no net found under the mark)
net class ETH; rule Differential Pairs Routing [Pref Gap = 0.254mm    Min Gap  = 0.254mm    Max Gap  = 0.254mmPref Width = 0.121mm    Min Width  = 0.096mm    Max Width  = 0.152mm]: RD_N, RD_P, TD_N, TD_P

### Notes on the sheet
- JACK LED

### Library data of the parts
C27#2 = CMP-13271-000387-1: as C26#2 on sheet STM32_IO; Depth: 0.5mm; Length: 1mm; Lead Free: Lead Free; Case Code (Metric): 1005; Width: 0.02inch; Min Operating Temperature: -55°C; Thickness: 0.022inch; Package Quantity: 1; Mount: Surface Mount; Height: 0.5mm; Material: Ceramic; Tolerance: 10%; Case Code (Imperial): 0402; Radiation Hardening: No; Case/Package: 0402; Max Operating Temperature: 125°C; Voltage Rating (DC): 50V; Contact Plating: Tin; Packaging: Tape and Reel; Voltage Rating: 50V; Dielectric: X7R
C101 C103 C104 C106-C108 = CMP-13271-002128-1: as C22 on sheet STM32_IO; Length: 0.039inch; Case Code (Metric): 1005; Thickness: 0.022inch; Max Operating Temperature: 125°C; Mount: Surface Mount; Features: Soft Termination; Width: 0.02inch; Min Operating Temperature: -55°C; Tolerance: 10%; Case/Package: 0402; Packaging: Cut Tape; Ratings: AEC-Q200; Case Code (Imperial): 0402; Lead Free: Lead Free
C102 C105 = CMP-2000-05442-2: CAP CER 10UF 25V X5R 0603; Dielectric Material: Ceramic; Tolerance: 20%; Dielectric: X5R; Length: 1.6mm; Termination: SMD/SMT; Depth: 0.8mm; RoHS Compliant: Yes; Construction: Flat; Weight: 7.1E-05oz; Thickness: 0.039inch; Packaging: Tape and Reel; Min Operating Temperature: -55°C; Case Code (Imperial): 0603; Case/Package: 0603; Height: 0.8mm; Case Code (Metric): 1608; Resistor Type: Ceramic; Voltage Rating (DC): 25V; Max Operating Temperature: 85°C; REACH SVHC: No SVHC; Lead Free: Lead Free; Series: C; Width: 0.8mm; Mount: Surface Mount; Package Quantity: 1
C109-C112 = CMP-2006-03068-2: CAP CER 0.1UF 50V 20% X7R 0603; Manufacturer: KEMET; Material: Ceramic; Tolerance: 0.2; Temperature Coefficient: 30ppm/°C; Automotive Grade: Grade 1; Capacitance: 0.10 μF; Temperature Range High: +125°C; Device Class L3: Ceramic Capacitors; Manufacturer Part Number: C0603C104M5RACTU; Height: 0.87mm; Category: Cap; RoHS: TRUE; Digikey Description: CAP CER 0.1UF 50V 20% X7R 0603; ComponentLink2URL: https://api.kemet.com/component-edge/download/datasheet/C0603C100J5GACAUTO.pdf; Lead Free: Yes; Temperature Range Low: -55°C; Device Class L1: Passive Components; ComponentLink2Description: Datasheet; Temperature Characteristic: X7R; Automotive: Yes; Temperature: -55°C to +125°C; Octopart: https://octopart.com/c0603c104m5ractu-kemet-11855687; Device Class L2: Capacitors; Package: C0603C-CF; Mouser Description: Multilayer Ceramic Capacitors MLCC - SMD/SMT 50volts 0.1uF X7R 20%
C113 C114 = CMP-2100-03589-1: as C26#1 on sheet STM32_IO; Termination: SMD/SMT; Package Reference: 0402; Voltage Rating (DC): 50V; Lead Free: LeadFree; Composition: Ceramic; Tolerance: 5%; Case Code (Metric): 1005; Packaging: TapeandReel; Manufacturer URL: http://www.yageo.com/; REACH SVHC: NoSVHC; Max Operating Temperature: 125degC; Length: 1mm; Mount: SurfaceMount; Depth: 0.5mm; Min Operating Temperature: -55degC; Number of Pins: 2; Width: 0.02inch; Datasheet Version: Rev. 14, 07/2016; Package Quantity: 1; Datasheet URL: http://www.yageo.com/documents/recent/UPY-GP_NP0_16V-to-50V_14.pdf; Case Code (Imperial): 0402; RoHSCompliant: True; Radiation Hardening: No; Height: 0.5mm; Case/Package: 0402; Thickness: 0.022inch; Package Description: 2-Pin Surface Mount Device, Body 1 x 0.5 mm; Voltage: 50V
D13 = CMP-1426-00006-6: as D11 on sheet USB; Packaging: Tape and Reel; REACH SVHC: Unknown; Width: 800µm; Max Operating Temperature: 85°C; Number of Pins: 2; RoHS: Compliant; Dominant Wavelength: 570nm; Min Operating Temperature: -40°C; Case Code (Imperial): 0603; Height: 700µm; Length: 1.6mm; Case Code (Metric): 1608; Case/Package: 0603; Max Reverse Voltage (DC): 5V; Mount: Surface Mount
J10 = J0011D01BNL: CONN MAGJACK 1PORT 100 BASE-TX; Manufacturer: Pulse; Number of Contacts: 8; Shielding: Shielded; Gender: Female; Current Rating: 8mA; Connector Type: RJ45; Number of Ports: 1; Direction: Down; Number of Cores per Jack: 4; Pitch: 2.54mm; Supplier: Avnet; Supplier Part Number: J0011D01BNL; Manufacturer Part Number: J0011D01BNL; RoHS: Yes; Category: Modular / Ethernet Connectors; Stock: 870; Pricing: 330=5.61455, 390=5.49838, 720=5.38222, 1650=5.26606, 3300=5.14989, 16500=5.03373, 33000=4.93693 (USD); Mounting Technology: Through Hole; Contact Plating: Gold; Contact Material: Bronze; Color: Green,Yellow; Housing Material: Thermoplastic; Min Operating Temperature: 0°C; Max Operating Temperature: 70°C; Termination: Solder; Orientation: Right Angle; Package Quantity: 30; Number of Rows: 1; Packaging: Tray; Number of Positions Loaded: 8; Series: PULSEJACK™ J0; Length: 16.26mm; Depth: 21.59mm; Radiation Hardening: No; Lead Free: Lead Free; RoHS Compliant: Yes; ComponentLink1URL: https://datasheet.ciiva.com/3138/+j403-3138718.pdf?src-supplier=Avnet; ComponentLink1Description: https://datasheet.ciiva.com/3138/+j403-3138718.pdf?src-supplier=Avnet; Supplier 1: Avnet; Supplier Part Number 1: J0011D01BNL
R2 = CMP-2000-02995-2: RES Thick Film, 1.5kΩ, 1%, 0.1W, 100ppm/°C, 0603; Working Voltage: 75V; Power Rating: 100mW; Max Operating Temperature: 155°C; Features: Automotive AEC-Q200; Min Operating Temperature: -55°C; Width: 0.033inch; Case/Package: 0603; Voltage Rating (DC): 75V; Termination: SMD/SMT; Mount: Surface Mount; Weight: 7.1E-05oz; Case Code (Metric): 1608; Height: 0.45mm; Voltage Rating: 75V; Length: 1.55mm; Package Quantity: 10; Lead Free: Lead Free; Composition: Thick Film; Packaging: Tape and Reel; Temperature Coefficient: 100ppm/°C; Tolerance: 1%; Military Standard: Not; Case Code (Imperial): 0603; Number of Terminations: 2; Max Power Dissipation: 100mW; Depth: 0.85mm; Contact Plating: Tin
R64 = CMP-2000-03817-2: RES Thick Film, 0Ω, , 0.33W, , 0603; Max Power Dissipation: 250mW; Voltage Rating (DC): 75V; Temperature Coefficient: 0ppm/°C; Mount: Surface Mount; Package Quantity: 5000; Features: Automotive AEC-Q200; Length: 1.6mm; Width: 0.033inch; Min Operating Temperature: -55°C; Max Operating Temperature: 155°C; Contact Plating: Tin; Depth: 0.85mm; Case/Package: 0603; Radiation Hardening: No; Military Standard: Not; Power Rating: 250mW; Height: 0.45mm; Composition: Thick Film; Lead Free: Lead Free; Voltage Rating: 75V; Case Code (Imperial): 0603; Weight: 7.1E-05oz; Number of Terminations: 2; Packaging: Tape and Reel; Number of Pins: 2; Case Code (Metric): 1608; Termination: SMD/SMT
R67-R70 = CMP-03412-018485-2: RES 49.9Ω 1.00% 0.1W 0603; Temperature Coefficient: 100ppm/°C; Max Power Dissipation: 100mW; Voltage Rating: 50V; Tolerance: 1%; Series: AC; Case Code (Imperial): 0603; Features: Moisture Resistant; Case/Package: 0603; Width: 0.8mm; Case Code (Metric): 1608; Termination: SMD/SMT; Number of Terminations: 2; Power Rating: 100mW; RoHS Compliant: Yes; Height: 0.022inch; Min Operating Temperature: -55°C; Ratings: AEC-Q200; Packaging: Tape and Reel; Max Operating Temperature: 155°C; Resistor Type: Thick Film; Length: 0.063inch; Construction: Rectangular; Depth: 0.8mm; Military Standard: Not
R127 = CMP-2100-03664-2: as R124 on sheet USB; Depth: 0.8mm; Termination: SMD/SMT; Resistor Type: Thick Film; Series: RC; Construction: Rectangular; Features: Moisture Resistant; Packaging: Tape and Reel; Min Operating Temperature: -55°C; Number of Terminations: 2; Lead Pitch: 0.3mm; RoHS Compliant: Yes; Case/Package: 0603; Resistance Tolerance: 1%; Military Standard: Not; Weight: 7.1E-05oz; Number of Pins: 2; Tolerance: 1%; Length: 1.6mm; Case Code (Imperial): 0603; Lead Free: Lead Free; Width: 0.8mm; Max Power Dissipation: 100mW; Height: 0.45mm; Max Operating Temperature: 155°C; Case Code (Metric): 1608; Size Code: 0603
R132 = CMP-2000-03420-2: RES Thick Film, 4.87kΩ, 1%, 0.1W, 100ppm/°C, 0603; Max Power Dissipation: 100mW; Voltage Rating (DC): 75V; Package Quantity: 10; Case/Package: 0603; Case Code (Imperial): 0603; Termination: SMD/SMT; Number of Pins: 2; Tolerance: 1%; Case Code (Metric): 1608; Military Standard: Not; Power Rating: 100mW; Weight: 7.1E-05oz; Max Operating Temperature: 155°C; Radiation Hardening: No; Height: 0.45mm; Packaging: Tape and Reel; Temperature Coefficient: 100ppm/°C; Voltage Rating: 75V; Number of Terminations: 2; Min Operating Temperature: -55°C; Length: 1.55mm; Lead Free: Lead Free; Features: Automotive AEC-Q200; Composition: Thick Film; Depth: 0.85mm; Contact Plating: Tin; Width: 0.033inch
R133-R136 R138 R140 = CMP-2000-04835-3: RES 2.2KΩ 1.00% 0.1W 0603; Tolerance: 1%; Max Power Dissipation: 100mW; Temperature Coefficient: 100ppm/°C; Voltage Rating: 50V; Features: Moisture Resistant; Size Code: 0603; Termination: SMD/SMT; Packaging: Tape and Reel; Min Operating Temperature: -55°C; Case/Package: 0603; Width: 0.031inch; Case Code (Metric): 1608; Package Quantity: 1; Height: 0.022inch; Number of Terminations: 2; Depth: 0.8mm; Construction: Rectangular; Power Rating: 100mW; Ratings: AEC-Q200; Series: AC; Case Code (Imperial): 0603; RoHS Compliant: Yes; Resistor Type: Thick Film; Military Standard: Not; Length: 0.063inch; Max Operating Temperature: 155°C; Lead Free: Lead Free
R137 R139 R141 = CMP-2000-03913-2: RES Thick Film, 150Ω, 1%, 0.1W, 100ppm/°C, 0603; Voltage Rating (DC): 75V; Max Power Dissipation: 100mW; Features: Automotive AEC-Q200; Weight: 7.1E-05oz; Number of Terminations: 2; Temperature Coefficient: 100ppm/°C; Military Standard: Not; Length: 1.55mm; Min Operating Temperature: -55°C; Termination: SMD/SMT; Tolerance: 1%; Composition: Thick Film; Depth: 0.85mm; Max Operating Temperature: 155°C; Width: 0.033inch; Lead Free: Lead Free; Height: 0.45mm; Case Code (Metric): 1608; Package Quantity: 10; Case Code (Imperial): 0603; Voltage Rating: 75V; Radiation Hardening: No; Contact Plating: Tin; Mount: Surface Mount; Packaging: Tape and Reel; Power Rating: 100mW; Case/Package: 0603
TP50-TP58 TP63-TP68 = CMP-1672-00008-1: Test Point, 1 Position SMD, RoHS, Tape and Reel; ComponentLink1Description: Manufacturer URL; Package Quantity: 1000; DatasheetVersion: 03/2014; Packaging: Tape and Reel; ComponentLink2URL: http://www.keyelco.com/product-pdf.cfm?p=1357; ComponentLink1URL: http://www.keyelco.com/; Mount: Surface Mount; Contact Plating: Silver; PackageDescription: 1-Pin Surface Mount Device, Body 3.81 x 2.03 mm; Pins: 1; RoHSCompliant: True; Mounting Technology: Surface Mount; ComponentLink2Description: Datasheet; PackageReference: 5019
U13 = CMP-0058-00763-3: Precision PHYTER® - IEEE 1588 Precision Time Protocol Transceiver, 48-pin LQFP, Pb-Free; Manufacturer: Texas Instruments; PowerWise: N; CompType: Interface IC; PackageTopMarking: NSUZXYTT*DP83640*TVV; PackageDescription: LQFP, 7 x 7 x 1.4mm, 48 Lead, 0.5mm Pitch; ComponentLink1Description: Datasheet URL; RoHS: Y; ComponentLink1URL: http://www.ti.com/general/docs/lit/getliterature.tsp?genericPartNumber=DP83640&fileType=pdf; PackageReference: PT0048A; PinCount: 48
Y3 = CMP-27762-000357-1: as Y2#2 on sheet STM32_IO; Height: 0.047inch; Series: ASE; Frequency Stability: 25ppm; Mount: Surface Mount; Case/Package: SMD/SMT; Width: 0.098inch; Operating Frequency: 25 MHz; REACH SVHC: No SVHC; Package Quantity: 1000; Number of Pins: 4; Termination: SMD/SMT; Frequency: 25MHz; Max Operating Temperature: 85°C; Packaging: Tape and Reel; Min Operating Temperature: -40°C; Lead Free: Lead Free; Length: 0.126inch; Operating Supply Voltage: 3.3V
Y4 = CMP-27762-010178-1: as Y2#1 on sheet STM32_IO; Mount: Surface Mount; Load Capacitance: 10pF; Frequency Tolerance: 10ppm; Max Operating Temperature: 85°C; Frequency: 25MHz; Case/Package: SMD/SMT; Length: 0.126inch; RoHS Compliant: Yes; Min Operating Temperature: -40°C; Width: 0.098inch; Height: 0.031inch; Packaging: Tape and Reel

## Sheet STM32_POWER.SchDoc
size A4; SheetNumber: 2; SheetTotal: 14
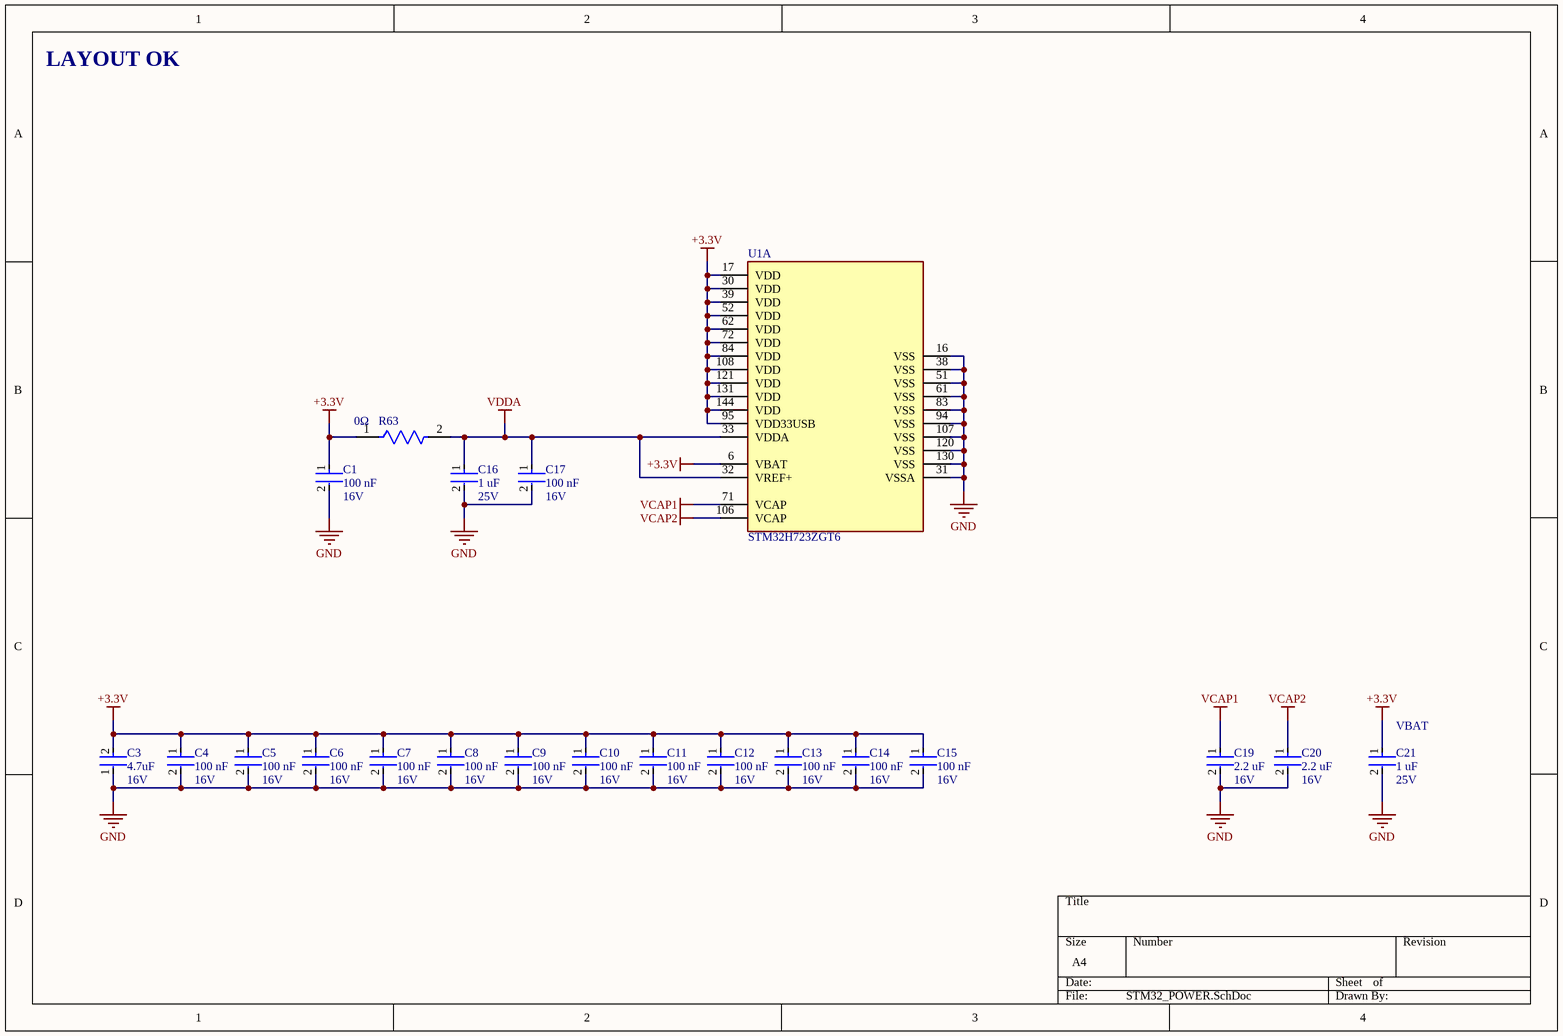
[diagram p5: STM32_POWER.SchDoc]

### Parts
C1  Capacitance: 100 nF  Voltage Rating: 16V  [FP-CL752-IPC_B]  (hidden comment: CL05B104KO5VPNC)
C3  Voltage: 16V  Capacitance: 4.7uF  [FP-C1608-080-0_1-IPC_B]  (hidden comment: C1608X5R1C475K080AC)
C4  Capacitance: 100 nF  Voltage Rating: 16V  [FP-CL752-IPC_B]  (hidden comment: CL05B104KO5VPNC)
C5  Capacitance: 100 nF  Voltage Rating: 16V  [FP-CL752-IPC_B]  (hidden comment: CL05B104KO5VPNC)
C6  Capacitance: 100 nF  Voltage Rating: 16V  [FP-CL752-IPC_B]  (hidden comment: CL05B104KO5VPNC)
C7  Capacitance: 100 nF  Voltage Rating: 16V  [FP-CL752-IPC_B]  (hidden comment: CL05B104KO5VPNC)
C8  Capacitance: 100 nF  Voltage Rating: 16V  [FP-CL752-IPC_B]  (hidden comment: CL05B104KO5VPNC)
C9  Capacitance: 100 nF  Voltage Rating: 16V  [FP-CL752-IPC_B]  (hidden comment: CL05B104KO5VPNC)
C10  Capacitance: 100 nF  Voltage Rating: 16V  [FP-CL752-IPC_B]  (hidden comment: CL05B104KO5VPNC)
C11  Capacitance: 100 nF  Voltage Rating: 16V  [FP-CL752-IPC_B]  (hidden comment: CL05B104KO5VPNC)
C12  Capacitance: 100 nF  Voltage Rating: 16V  [FP-CL752-IPC_B]  (hidden comment: CL05B104KO5VPNC)
C13  Capacitance: 100 nF  Voltage Rating: 16V  [FP-CL752-IPC_B]  (hidden comment: CL05B104KO5VPNC)
C14  Capacitance: 100 nF  Voltage Rating: 16V  [FP-CL752-IPC_B]  (hidden comment: CL05B104KO5VPNC)
C15  Capacitance: 100 nF  Voltage Rating: 16V  [FP-CL752-IPC_B]  (hidden comment: CL05B104KO5VPNC)
C16  Capacitance: 1 uF  Voltage Rating: 25V  [FP-GCM188-0_1-IPC_B]  (hidden comment: GCM188R71E105KA64D)
C17  Capacitance: 100 nF  Voltage Rating: 16V  [FP-CL752-IPC_B]  (hidden comment: CL05B104KO5VPNC)
C19  Capacitance: 2.2 uF  Voltage Rating: 16V  [FP-CL10-IPC_B]  (hidden comment: CL10A225KO8NNNC)
C20  Capacitance: 2.2 uF  Voltage Rating: 16V  [FP-CL10-IPC_B]  (hidden comment: CL10A225KO8NNNC)
C21  Capacitance: 1 uF  Voltage Rating: 25V  [FP-GCM188-0_1-IPC_B]  (hidden comment: GCM188R71E105KA64D)
R63  Resistance: 0Ω  [FP-CRCW0603-HPe3-IPC_B]  (hidden comment: CRCW06030000Z0EAHP)
U1  STM32H723ZGT6  [CQFP50P2200X2200X160-144M]  (part A of 3)

### Nets
+3.3V: C1.1 C3.2 C4.1 C5.1 C6.1 C7.1 C8.1 C9.1 C10.1 C11.1 C12.1 C13.1 C14.1 C15.1 C21.1 R63.1 U1.6(VBAT) U1.17(VDD) U1.30(VDD) U1.39(VDD) U1.52(VDD) U1.62(VDD) U1.72(VDD) U1.84(VDD) U1.95(VDD33USB) U1.108(VDD) U1.121(VDD) U1.131(VDD) U1.144(VDD)
GND: C1.2 C3.1 C4.2 C5.2 C6.2 C7.2 C8.2 C9.2 C10.2 C11.2 C12.2 C13.2 C14.2 C15.2 C16.2 C17.2 C19.2 C20.2 C21.2 U1.16(VSS) U1.31(VSSA) U1.38(VSS) U1.51(VSS) U1.61(VSS) U1.83(VSS) U1.94(VSS) U1.107(VSS) U1.120(VSS) U1.130(VSS)
VCAP1: C19.1 U1.71(VCAP)
VCAP2: C20.1 U1.106(VCAP)
VDDA: C16.1 C17.1 R63.2 U1.32(VREF+) U1.33(VDDA)

### Notes on the sheet
- LAYOUT OK
- (near C21) VBAT

### Library data of the parts
C1 C4-C15 C17 = CMP-13271-002128-1: as C22 on sheet STM32_IO; Length: 0.039inch; Case Code (Metric): 1005; Thickness: 0.022inch; Max Operating Temperature: 125°C; Mount: Surface Mount; Features: Soft Termination; Width: 0.02inch; Min Operating Temperature: -55°C; Tolerance: 10%; Case/Package: 0402; Packaging: Cut Tape; Ratings: AEC-Q200; Case Code (Imperial): 0402; Lead Free: Lead Free
C3 = CMP-2000-04981-2: as C99 on sheet USB; Tolerance: 10%; Thickness: 0.035inch; Length: 1.6mm; Width: 0.031inch; Height: 0.8mm; Package Quantity: 1; Construction: Flat; Weight: 7.1E-05oz; Depth: 0.8mm; Case Code (Metric): 1608; Series: C; Lead Free: Lead Free; Voltage Rating: 16V; Voltage Rating (DC): 16V; Termination: SMD/SMT; Dielectric: X5R; REACH SVHC: No SVHC; RoHS Compliant: Yes; Case Code (Imperial): 0603; Case/Package: 0603; Mount: Surface Mount; Dielectric Material: Ceramic; Packaging: Tape and Reel; Min Operating Temperature: -55°C; Max Operating Temperature: 85°C
C16 C21 = CMP-2006-02363-4: Manufacturer Lifecycle Status: IN PRODUCTION; NexarPartId: 18909256; Dielectric: X7R; Material: Ceramic; Tolerance: 10%; Thickness: 889µm; Max Operating Temperature: 125°C; Radiation Hardening: No; Weight: 6.293594mg; Lead Free: Lead Free; Mount: Surface Mount; Case Code (Imperial): 0603; REACH SVHC: No SVHC; Lifecycle Status: Production; Depth: 800µm; Min Operating Temperature: -55°C; Height: 800µm; Case Code (Metric): 1608; Case/Package: 0603; Voltage: 25V; Packaging: Cut Tape; Length: 1.6mm; Termination: SMD/SMT; Width: 787.4µm; Voltage Rating (DC): 25V; RoHS: Compliant; Schedule B: 8532240020, 8532240020; Ratings: AEC-Q200
C19 C20 = CMP-13271-000835-1: Cap Ceramic 2.2uF 16V X5R ±10% Pad SMD 0603 +85°C T/R; Case Code (Metric): 1608; Height: 0.8mm; Case/Package: 0603; Depth: 0.8mm; Case Code (Imperial): 0603; Length: 1.6mm; Packaging: Tape and Reel; Material: Ceramic; Lead Free: Lead Free; Max Operating Temperature: 85°C; Contact Plating: Tin; Thickness: 0.035inch; Radiation Hardening: No; Tolerance: 10%; Min Operating Temperature: -55°C; Voltage: 16V; Dielectric: X5R; Mount: Surface Mount; Package Quantity: 4000; Width: 0.031inch; Voltage Rating (DC): 16V
R63 = CMP-2000-03817-2: as R64 on sheet DP83640; Mount: Surface Mount; Package Quantity: 5000; Features: Automotive AEC-Q200; Length: 1.6mm; Width: 0.033inch; Min Operating Temperature: -55°C; Max Operating Temperature: 155°C; Contact Plating: Tin; Depth: 0.85mm; Case/Package: 0603; Radiation Hardening: No; Military Standard: Not; Power Rating: 250mW; Height: 0.45mm; Composition: Thick Film; Lead Free: Lead Free; Voltage Rating: 75V; Case Code (Imperial): 0603; Weight: 7.1E-05oz; Number of Terminations: 2; Packaging: Tape and Reel; Number of Pins: 2; Case Code (Metric): 1608; Termination: SMD/SMT
U1 = STM32H723ZGT6: as U1 on sheet STM32_IO; Supplier: Arrow Electronics; Supplier Part Number: STM32H723ZGT6; Manufacturer Part Number: STM32H723ZGT6; RoHS: No; Category: Microcontrollers; Stock: 2596; Pricing: 1=9.275, 10=9.182, 25=9.09, 50=8.999, 120=8.909, 300=8.175, 540=8.094 (USD); Min Operating Temperature: -40°C; Max Operating Temperature: 85°C; Frequency: 550MHz; Memory Size: 1MB; Number of Ethernet Channels: 1NUMBER; Number of UART Channels: 6NUMBER; Number of USB Channels: 1NUMBER; Height: 1.6mm